# Altium project Gastroscopy-CutController.PrjPcb (part 2 of 2)

## Sheet Gastroscopy-CutController_Accelerometer.SchDoc: Accelerometer
size 279 x 215 mm; Date: not used; ApprovedBy: not used; CheckedBy: not used; Author: not used; CompanyName: MRobot, LCC; DrawnBy: not used; Engineer: Podlesnyi Vasilii; Organization: not used; Address1: nab. reki Karpovki, d. 5/3E; Address2: Saint-Petersburg, 197022; Address3: Ph: +7 (911) 701-51-99; Address4: not used; DocumentNumber: 0000-0000; Revision: 0.1.0; SheetNumber: 3; SheetTotal: 8; ProjectTitle: Gastroscopy CutController; Time: not used; ImagePath: not used; Application_BuildNumber: not used
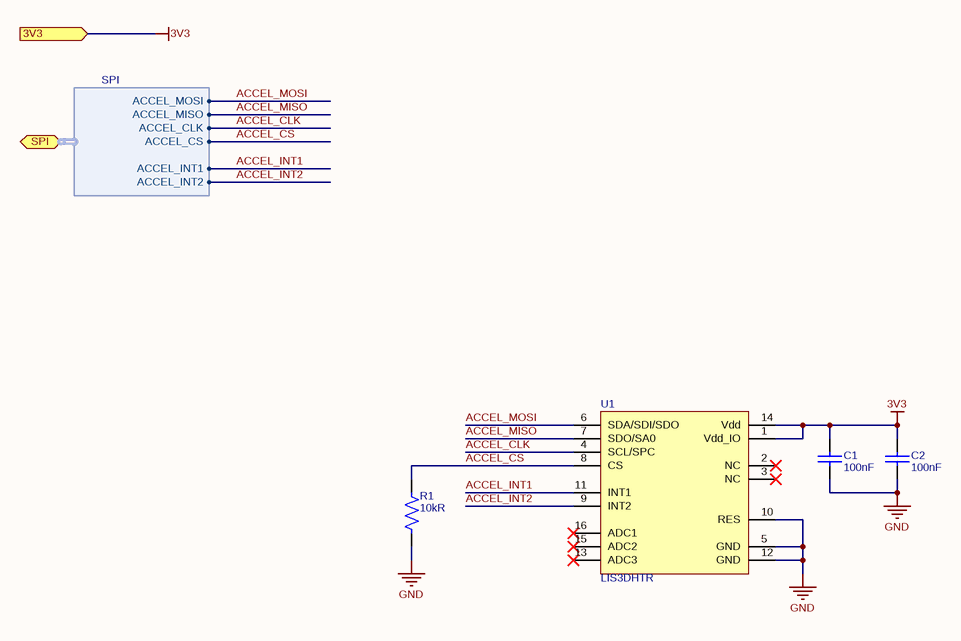
[diagram p4: Gastroscopy-CutController_Accelerometer.SchDoc]

### Parts
C1  100nF  [CAP_0603]
C2  100nF  [CAP_0603]
R1  10kR  [RES_0603]
U1  LIS3DHTR  [LIS3DHTR]

### Ports
3V3 (in), SPI (bidir, harness SPI)

### Harnesses
SPI: ACCEL_MOSI, ACCEL_MISO, ACCEL_CLK, ACCEL_INT1, ACCEL_CS, ACCEL_INT2

### Nets
3V3: C1.1 C2.1 U1.1(Vdd_IO) U1.14(Vdd) ; port 3V3
GND: C1.2 C2.2 R1.2 U1.5(GND) U1.10(RES) U1.12(GND)
ACCEL_CLK: U1.4(SCL/SPC) ; port SPI.ACCEL_CLK
ACCEL_CS: R1.1 U1.8(CS) ; port SPI.ACCEL_CS
ACCEL_INT1: U1.11(INT1) ; port SPI.ACCEL_INT1
ACCEL_INT2: U1.9(INT2) ; port SPI.ACCEL_INT2
ACCEL_MISO: U1.7(SDO/SA0) ; port SPI.ACCEL_MISO
ACCEL_MOSI: U1.6(SDA/SDI/SDO) ; port SPI.ACCEL_MOSI

Not connected (* = marked no-connect by the designer): U1 2(NC)* 3(NC)* 13(ADC3)* 15(ADC2)* 16(ADC1)*

### Notes on the sheet
- Title:
- Date:
- Size A
- Project:
- Number:
- Time:
- Sheet
- Revision
- of
- Engineer:
- www.mrobots.ru <http://mrobots.ru/>
- File:

### Library data of the parts
C1 C2 = CL10B104KB8NNNL: CAP CER 0.1UF 50V X7R 0603; Manufacturer 1: Samsung; Tolerance: 10%; Supplier 1: Digi-Key; Manufacturer Part Number 1: CL10B104KB8NNNL; RoHS: Yes; Category: Ceramic Capacitors; Stock 1: 2348404; Pricing 1: 15000=0,00532, 30000=0,00506 (USD); Mount: Surface Mount; Case/Package: 0603; Min Operating Temperature: -55°C; Max Operating Temperature: 125°C; Capacitance: 100nF; Packaging: Tape and Reel; Package Quantity: 15000; Voltage Rating: 50V; Dielectric: X7R; Voltage Rating (DC): 50V; Series: CL; Construction: Flat; Length: 1.6mm; Width: 0.031inch; Height: 0.8mm; Thickness: 0.035inch; Depth: 0.8mm; Radiation Hardening: No; RoHS Compliant: Yes; ComponentLink1URL: https://datasheet.ciiva.com/26838/getdatasheetpartid-357523-26838415.pdf?src-supplier=Verical; ComponentLink1Description: https://datasheet.ciiva.com/26838/getdatasheetpartid-357523-26838415.pdf?src-supplier=Verical; ComponentLink2URL: https://datasheet.ciiva.com/25741/cl10b104kb8nnnl-25741341.pdf?src-supplier=Digi-Key; ComponentLink2Description: https://datasheet.ciiva.com/25741/cl10b104kb8nnnl-25741341.pdf?src-supplier=Digi-Key; Supplier Part Number 1: 1276-CL10B104KB8NNNLTR-ND
R1 = RC0603FR-0710KL: RES 10K OHM 1% 1/10W 0603; Manufacturer 1: Yageo; Voltage Rating (DC): 50V; Temperature Coefficient: 100ppm/°C; Power Rating: 100mW; Voltage Rating: 75V; Supplier 1: Arrow Electronics; RoHS: Yes; Category: Chip SMD Resistors; Stock 1: 4950000; Pricing 1: 5000=0,00240 (USD); Case/Package: 0603; Number of Pins: 2; Case Code (Imperial): 0603; Case Code (Metric): 1608; Weight: 7.1E-05oz; Size Code: 0603; Min Operating Temperature: -55°C; Max Operating Temperature: 155°C; Packaging: Tape and Reel; Resistance: 10kR; Tolerance: 1%; Resistor Type: Thick Film; Termination: SMD/SMT; Features: Moisture Resistant; Series: RC; Max Power Dissipation: 100mW; Number of Terminations: 2; Resistance Tolerance: 1%; Construction: Rectangular; Length: 1.6mm; Width: 0.8mm; Height: 0.45mm; Depth: 0.8mm; Lead Pitch: 0.3mm; REACH SVHC: Unknown; Lead Free: Lead Free; Military Standard: Not; RoHS Compliant: Yes; ComponentLink1URL: https://datasheet.ciiva.com/7660/38590-7660789.pdf?src-supplier=Element14; ComponentLink1Description: https://datasheet.ciiva.com/7660/38590-7660789.pdf?src-supplier=Element14; ComponentLink2URL: https://datasheet.ciiva.com/7983/443971-7983596.pdf?src-supplier=Element14; ComponentLink2Description: https://datasheet.ciiva.com/7983/443971-7983596.pdf?src-supplier=Element14; ComponentLink3URL: https://datasheet.ciiva.com/22747/443971-22747519.pdf?src-supplier=Element14; ComponentLink3Description: https://datasheet.ciiva.com/22747/443971-22747519.pdf?src-supplier=Element14; ComponentLink4URL: https://datasheet.ciiva.com/46440/1868787-46440891.pdf?src-supplier=Element14; ComponentLink4Description: https://datasheet.ciiva.com/46440/1868787-46440891.pdf?src-supplier=Element14; ComponentLink5URL: https://datasheet.ciiva.com/7746/1738695-7746239.pdf?src-supplier=Element14; ComponentLink5Description: https://datasheet.ciiva.com/7746/1738695-7746239.pdf?src-supplier=Element14; Supplier Part Number 1: RC0603FR-0710KL; Manufacturer Part Number 1: RC0603FR-0710KL
U1 = LIS3DHTR: ACCEL 2-16G I2C/SPI 16LGA; Manufacturer 1: STMicroelectronics; Max Supply Voltage: 3.6V; Min Supply Voltage: 1.71V; Operating Supply Voltage: 2.5V; Bandwidth: 5kHz; Interface: I2C,SPI; Resolution: 16b; Operating Supply Current: 11uA; Sensor Type: 3 Axis; Output Type: Digital; Axis: X, Y, Z; Supplier 1: Future Electronics; Manufacturer Part Number 1: LIS3DHTR; RoHS: Yes; Category: Accelerometers; Pricing 1: 4000=0,99000 (USD); Case/Package: LGA; Number of Pins: 16; Contact Plating: Gold; Min Operating Temperature: -40°C; Max Operating Temperature: 85°C; Package Quantity: 4000; Packaging: Tape and Reel; Max Supply Voltage (DC): 3.6V; Min Supply Voltage (DC): 1.71V; Series: -; Length: 3mm; Width: 3mm; Height: 1mm; Depth: 3mm; Radiation Hardening: No; Reach SVHC Compliant: Yes; Lead Free: Lead Free; RoHS Compliant: Yes; ComponentLink1URL: https://datasheet.ciiva.com/7621/1718591-7621744.pdf?src-supplier=Element14; ComponentLink1Description: https://datasheet.ciiva.com/7621/1718591-7621744.pdf?src-supplier=Element14; ComponentLink2URL: https://datasheet.ciiva.com/5296/cd00274221-117431-5296513.pdf?src-supplier=Mouser; ComponentLink2Description: https://datasheet.ciiva.com/5296/cd00274221-117431-5296513.pdf?src-supplier=Mouser; ComponentLink3URL: https://datasheet.ciiva.com/2810/cd00274221-2810009.pdf?src-supplier=Digi-Key; ComponentLink3Description: https://datasheet.ciiva.com/2810/cd00274221-2810009.pdf?src-supplier=Digi-Key; ComponentLink4URL: https://datasheet.ciiva.com/2810/cd00274221-2810008.pdf?src-supplier=Digi-Key; ComponentLink4Description: https://datasheet.ciiva.com/2810/cd00274221-2810008.pdf?src-supplier=Digi-Key; ComponentLink5URL: https://datasheet.ciiva.com/2810/cd00274221-2810010.pdf?src-supplier=Digi-Key; ComponentLink5Description: https://datasheet.ciiva.com/2810/cd00274221-2810010.pdf?src-supplier=Digi-Key; ComponentLink6URL: https://datasheet.ciiva.com/48495/cd00274221-48495849.pdf?src-supplier=Avnet; ComponentLink6Description: https://datasheet.ciiva.com/48495/cd00274221-48495849.pdf?src-supplier=Avnet; ComponentLink7URL: https://datasheet.ciiva.com/3271/cd00274221-3271807.pdf?src-supplier=Avnet; ComponentLink7Description: https://datasheet.ciiva.com/3271/cd00274221-3271807.pdf?src-supplier=Avnet; ComponentLink8URL: https://datasheet.ciiva.com/16216/cd00274221-16216362.pdf?src-supplier=Future+Electronics; ComponentLink8Description: https://datasheet.ciiva.com/16216/cd00274221-16216362.pdf?src-supplier=Future+Electronics; Supplier Part Number 1: 9001914

## Sheet Gastroscopy-CutController_Button.SchDoc: Buttons
size 279 x 215 mm; Date: not used; ApprovedBy: not used; CheckedBy: not used; Author: not used; CompanyName: MRobot, LCC; DrawnBy: not used; Engineer: Podlesnyi Vasilii; Organization: not used; Address1: nab. reki Karpovki, d. 5/3E; Address2: Saint-Petersburg, 197022; Address3: Ph: +7 (911) 701-51-99; Address4: not used; DocumentNumber: 0000-0000; Revision: 0.1.0; SheetNumber: 4; SheetTotal: 8; ProjectTitle: Gastroscopy CutController; Time: not used; ImagePath: not used; Application_BuildNumber: not used
Used 4 times, as channels Overview/Buttons1, Overview/Buttons2, Overview/Buttons3, Overview/Buttons4. Parts and nets are listed once, with the designators drawn on the sheet.
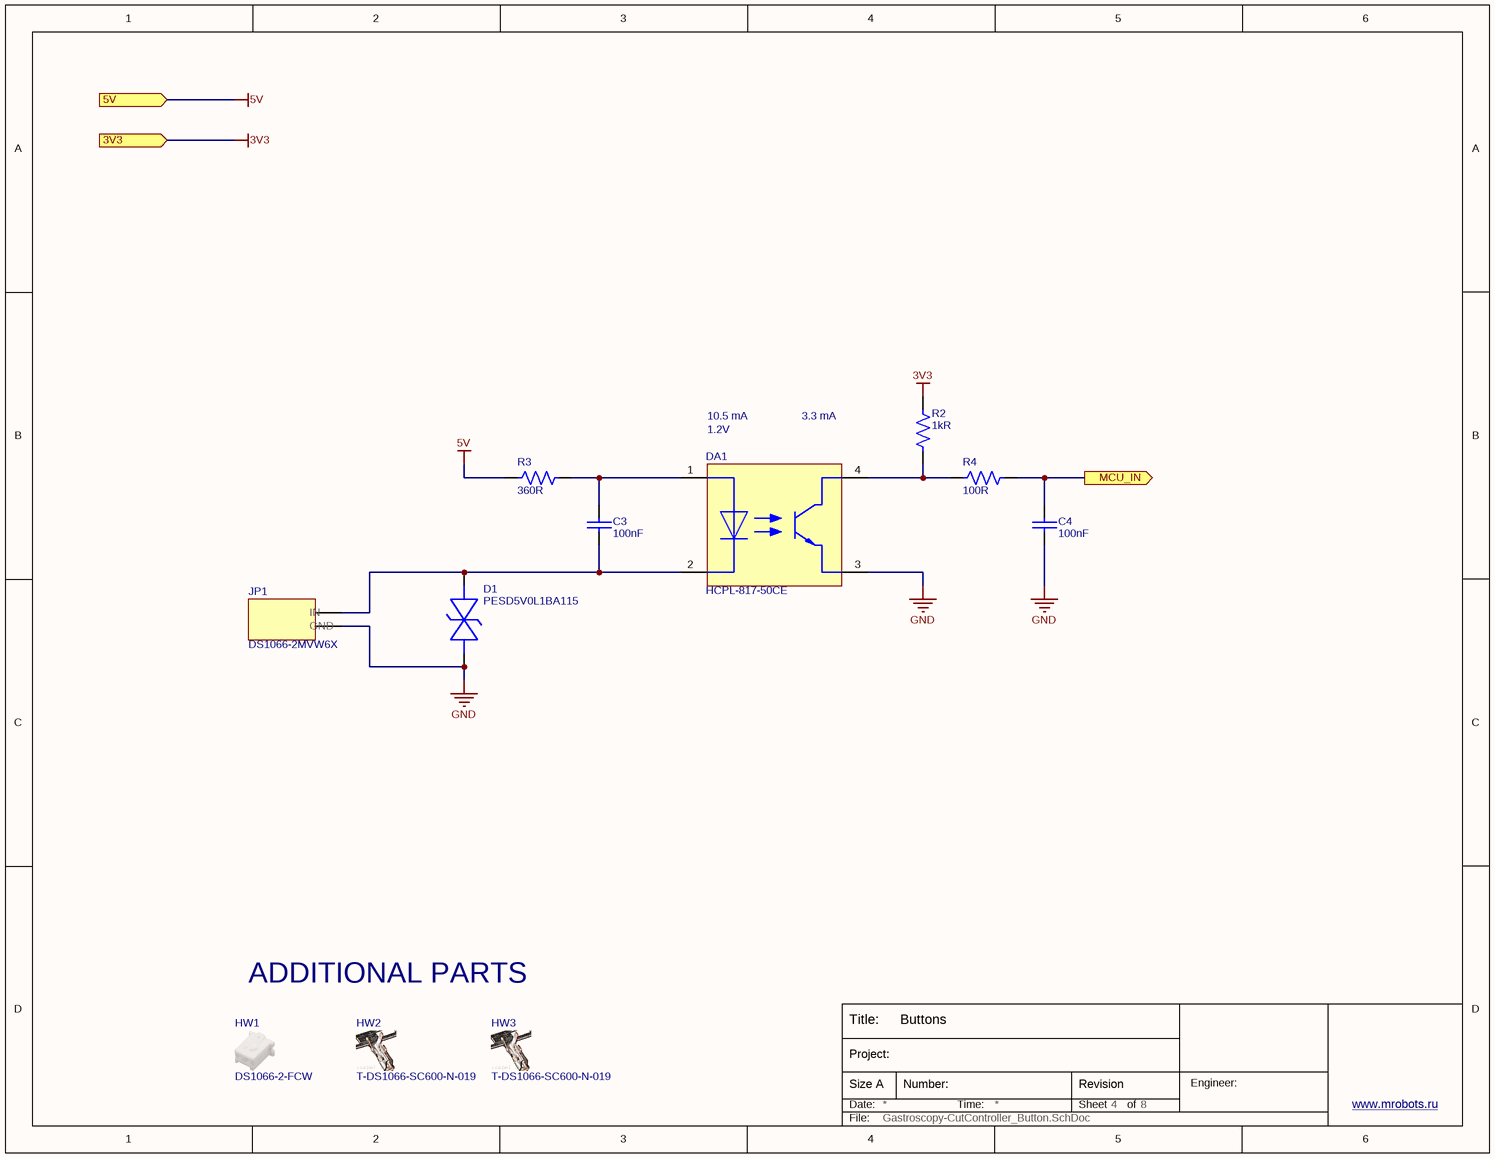
[diagram p5: Gastroscopy-CutController_Button.SchDoc]

### Parts
C3  100nF  [CAP_0603]
C4  100nF  [CAP_0603]
D1  PESD5V0L1BA115  [SOD-323]
DA1  HCPL-817-50CE  [HCPL-817-50CE]
HW1  DS1066-2-FCW  (mechanical)
HW2  T-DS1066-SC600-N-019  (mechanical)
HW3  T-DS1066-SC600-N-019  (mechanical)
JP1  DS1066-2MVW6X  [DS1066-2MVW6X]
R2  1kR  [RES_0603]
R3  360R  [RES_0603]
R4  100R  [RES_0603]

### Ports
3V3 (in), 5V (in), MCU_IN (out)

### Nets
3V3: R2.1 ; port 3V3
5V: R3.1 ; port 5V
GND: C4.2 D1.2 DA1.3(EMITTER) JP1.2
MCU_IN: C4.1 R4.1 ; port MCU_IN
NetC3_1: C3.1 DA1.1(ANODE) R3.2
NetC3_2: C3.2 D1.1 DA1.2(CATHODE) JP1.1
NetDA1_4: DA1.4(COLLECTOR) R2.2 R4.2

### Channels
Overview/Buttons1: designators C3=C3 C4=C4 D1=D1 DA1=DA1 HW1=HW1A HW2=HW2A HW3=HW3A JP1=JP1 R2=R3 R3=R2 R4=R4; ports 3V3=3V3 5V=5V MCU_IN=MCU_IN1
Overview/Buttons2: designators C3=C5#1 C4=C6#1 D1=D2#1 DA1=DA2#2 HW1=HW1B HW2=HW2B HW3=HW3B JP1=JP2#1 R2=R6#1 R3=R5#1 R4=R7#1; ports 3V3=3V3 5V=5V MCU_IN=MCU_IN2
Overview/Buttons3: designators C3=C7#2 C4=C8#2 D1=D3#2 DA1=DA3 HW1=HW1C HW2=HW2C HW3=HW3C JP1=JP3#1 R2=R9#2 R3=R8#2 R4=R10#2; ports 3V3=3V3 5V=5V MCU_IN=MCU_IN3
Overview/Buttons4: designators C3=C9#2 C4=C10#2 D1=D4#2 DA1=DA4 HW1=HW1D HW2=HW2D HW3=HW3D JP1=JP4#2 R2=R12#2 R3=R11#2 R4=R13#1; ports 3V3=3V3 5V=5V MCU_IN=MCU_IN4

### Notes on the sheet
- (near DA1) 1.2V
- 10.5 mA
- 3.3 mA
- ADDITIONAL PARTS
- Title:
- Date:
- Size A
- Project:
- Number:
- Time:
- Sheet
- Revision
- of
- Engineer:
- www.mrobots.ru <http://mrobots.ru/>
- File:

### Library data of the parts
C3 C4 = CL10B104KB8NNNL: as C1 on sheet Gastroscopy-CutController_Accelerometer; Supplier 1: Digi-Key; Manufacturer Part Number 1: CL10B104KB8NNNL; RoHS: Yes; Category: Ceramic Capacitors; Stock 1: 2348404; Pricing 1: 15000=0,00532, 30000=0,00506 (USD); Mount: Surface Mount; Case/Package: 0603; Min Operating Temperature: -55°C; Max Operating Temperature: 125°C; Capacitance: 100nF; Packaging: Tape and Reel; Package Quantity: 15000; Voltage Rating: 50V; Dielectric: X7R; Voltage Rating (DC): 50V; Series: CL; Construction: Flat; Length: 1.6mm; Width: 0.031inch; Height: 0.8mm; Thickness: 0.035inch; Depth: 0.8mm; Radiation Hardening: No; RoHS Compliant: Yes; ComponentLink1URL: https://datasheet.ciiva.com/26838/getdatasheetpartid-357523-26838415.pdf?src-supplier=Verical; ComponentLink1Description: https://datasheet.ciiva.com/26838/getdatasheetpartid-357523-26838415.pdf?src-supplier=Verical; ComponentLink2URL: https://datasheet.ciiva.com/25741/cl10b104kb8nnnl-25741341.pdf?src-supplier=Digi-Key; ComponentLink2Description: https://datasheet.ciiva.com/25741/cl10b104kb8nnnl-25741341.pdf?src-supplier=Digi-Key; Supplier Part Number 1: 1276-CL10B104KB8NNNLTR-ND
D1 = PESD5V0L1BA,115: TVS DIODE 5VWM 33VC SOD323; Manufacturer 1: NXP Semiconductors; Description: Diode Esd Prot; Direction: Bidirectional; Capacitance: 75pF; Number of Channels: 1; Reverse Breakdown Voltage: 7V; Operating Supply Voltage: 5V; Max Surge Current: 15A; Clamping Voltage: 33V; Peak Pulse Power: 500W; Power Line Protection: No; Leakage Current: 1uA; Max Breakdown Voltage: 8.2V; Test Current: 5mA; Element Configuration: Single; Diode Type: ZENER; Supplier 1: Newark; Manufacturer Part Number 1: PESD5V0L1BA115; RoHS: Yes; Category: Uncategorized; Mount: Surface Mount; Number of Pins: 2; Weight: 0.01lb; Contact Plating: Tin; Min Operating Temperature: -65°C; Max Operating Temperature: 150°C; Package Quantity: 1; Packaging: Cut Tape; Number of Elements: 1; Number of Bidirectional Channels: 1; Reverse Standoff Voltage: 5V; Min Breakdown Voltage: 7V; Polarity: Bidirectional; Breakdown Voltage: 7V; Termination: SMD/SMT; Working Voltage: 5V; Peak Pulse Current: 15A; Max Power Dissipation: 500W; Resistor Type: Zener; Series: -; Clamping Voltage-Max: 33V; Length: 1.8mm; Width: 0.25inch; Height: 0.25inch; Depth: 1.35mm; Radiation Hardening: No; Reach SVHC Compliant: Yes; Lead Free: Lead Free; ComponentLink1URL: https://datasheet.ciiva.com/334/pesdxl1ba-ser-334048.pdf?src-supplier=Digi-Key; ComponentLink1Description: https://datasheet.ciiva.com/334/pesdxl1ba-ser-334048.pdf?src-supplier=Digi-Key; ComponentLink2URL: https://datasheet.ciiva.com/1219/682594-1219455.pdf?src-supplier=Newark; ComponentLink2Description: https://datasheet.ciiva.com/1219/682594-1219455.pdf?src-supplier=Newark; ComponentLink3URL: https://datasheet.ciiva.com/334/pesdxl1ba-ser-334050.pdf?src-supplier=Digi-Key; ComponentLink3Description: https://datasheet.ciiva.com/334/pesdxl1ba-ser-334050.pdf?src-supplier=Digi-Key; ComponentLink4URL: https://datasheet.ciiva.com/334/pesdxl1ba-ser-334051.pdf?src-supplier=Digi-Key; ComponentLink4Description: https://datasheet.ciiva.com/334/pesdxl1ba-ser-334051.pdf?src-supplier=Digi-Key; ComponentLink5URL: https://datasheet.ciiva.com/6574/pesdxl1ba-ser-6574197.pdf?src-supplier=Digi-Key; ComponentLink5Description: https://datasheet.ciiva.com/6574/pesdxl1ba-ser-6574197.pdf?src-supplier=Digi-Key; Supplier Part Number 1: 70R7330
DA1 = HCPL-817-50CE: OPTOISOLATOR 5KV TRANSISTOR 4SMD; Manufacturer 1: Broadcom Avago; Reverse Breakdown Voltage: 6V; Forward Voltage: 1.2V; Forward Current: 50mA; Rise Time: 18000ns; Max Power Dissipation: 200mW; Number of Channels: 1; Collector Emitter Voltage (VCEO): 35V; Collector Emitter Saturation Voltage: 200mV; Max Output Voltage: 70V; Current Transfer Ratio: 400%; Input Current: 20mA; Input Type: DC; Approvals: UL; Supplier 1: Mouser; RoHS: Yes; Category: Optocouplers; Stock 1: 53747; Pricing 1: 1=0,55000, 10=0,35900, 50=0,35900, 100=0,23700, 1000=0,18200, 10000=0,15000 (USD); Mount: Surface Mount; Case/Package: SMD/SMT; Number of Pins: 4; Min Operating Temperature: -30°C; Max Operating Temperature: 100°C; Package Quantity: 1000; Packaging: Tape and Reel; Max Collector Current: 50mA; Output Current per Channel: 50mA; Number of Elements: 1; Power Dissipation: 200mW; Fall Time: 18000ns; Max Input Current: 50mA; Collector Emitter Breakdown Voltage: 70V; Isolation Voltage: 5kV; Number of Circuits: 1; Output Voltage: 70V; Series: -; Collector-emitter Voltage-Max: 200mV; Lead Free: Lead Free; RoHS Compliant: Yes; ComponentLink1URL: https://datasheet.ciiva.com/32424/hcpl-817-00ae-eng-tds-32424469.pdf?src-supplier=Distrelec; ComponentLink1Description: https://datasheet.ciiva.com/32424/hcpl-817-00ae-eng-tds-32424469.pdf?src-supplier=Distrelec; ComponentLink2URL: https://datasheet.ciiva.com/4702/v02-0265en-106799-4702156.pdf?src-supplier=Mouser; ComponentLink2Description: https://datasheet.ciiva.com/4702/v02-0265en-106799-4702156.pdf?src-supplier=Mouser; Supplier Part Number 1: 630-HCPL-817-50CE; Manufacturer Part Number 1: HCPL-817-50CE
HW1 = DS1066-2-FCW: CONN SOCKET 2POS 2MM; Manufacturer 1: Connfly electronic (Zhenqin); Manufacturer Part Number 1: DS1066-2-FCW
HW2 HW3 = T-DS1066-SC600-N-019: СONNECTOR DS1066; Manufacturer 1: Connfly electronic (Zhenqin); Manufacturer Part Number 1: T-DS1066-SC600-N-019
JP1 = DS1066-2MVW6X: CONN HEADER 2POS 2MM; Manufacturer 1: Connfly electronic (Zhenqin); Contact_1: IN; Contact_2: GND; Manufacturer Part Number 1: DS1066-2MVW6X
R2 = RC0603FR-071KL: RES 1K OHM 1% 1/10W 0603; Manufacturer 1: Yageo; Temperature Coefficient: 100ppm/°C; Power Rating: 100mW; Voltage Rating: 50V; Supplier 1: Arrow Electronics; Manufacturer Part Number 1: RC0603FR-071KL; RoHS: Yes; Category: Chip SMD Resistors; Stock 1: 480000; Pricing 1: 5000=0,00240, 10000=0,00230, 25000=0,00220, 125000=0,00190 (USD); Case/Package: 0603; Contact Plating: Tin,Matte; Case Code (Imperial): 0603; Case Code (Metric): 1608; Size Code: 0603; Min Operating Temperature: -55°C; Max Operating Temperature: 155°C; Tolerance: 1%; Resistance: 1kR; Packaging: Tape and Reel; Resistor Type: Thick Film; Termination: SMD/SMT; Features: Moisture Resistant; Series: RC; Max Power Dissipation: 100mW; Number of Terminations: 2; Technology: THICK FILM; Resistance Tolerance: 1%; Construction: Rectangular; Length: 1.6mm; Height: 0.45mm; Depth: 0.8mm; Radiation Hardening: No; REACH SVHC: No SVHC; Lead Free: Lead Free; Military Standard: Not; RoHS Compliant: Yes; Supplier Part Number 1: RC0603FR-071KL
R3 = RC0603FR-07360RL: RES 360 OHM 1% 1/10W 0603; Manufacturer 1: Yageo; Power Rating: 100mW; Voltage Rating: 50V; Temperature Coefficient: 100ppm/°C; Supplier 1: Arrow Electronics; RoHS: Yes; Category: Chip SMD Resistors; Stock 1: 7884; Pricing 1: 1=0,05320, 10=0,01120, 100=0,00760, 250=0,00660, 1000=0,00380, 3000=0,00370, 6000=0,00230 (USD); Case/Package: 0603; Case Code (Metric): 1608; Case Code (Imperial): 0603; Size Code: 0603; Min Operating Temperature: -55°C; Max Operating Temperature: 155°C; Packaging: Tape and Reel; Resistance: 360R; Tolerance: 1%; Package Quantity: 1; Resistor Type: Thick Film; Number of Terminations: 2; Termination: SMD/SMT; Max Power Dissipation: 100mW; Voltage Rating (DC): 50V; Features: Moisture Resistant; Series: RC; Construction: Rectangular; Length: 1.6mm; Width: 0.031inch; Height: 0.022inch; Depth: 0.8mm; Military Standard: Not; Lead Free: Lead Free; RoHS Compliant: Yes; ComponentLink1URL: https://datasheet.ciiva.com/2454/pyu-r-int-thick-7-2454271.pdf?src-supplier=Digi-Key; ComponentLink1Description: https://datasheet.ciiva.com/2454/pyu-r-int-thick-7-2454271.pdf?src-supplier=Digi-Key; ComponentLink2URL: https://datasheet.ciiva.com/2454/pyu-r-int-thick-7-2454272.pdf?src-supplier=Digi-Key; ComponentLink2Description: https://datasheet.ciiva.com/2454/pyu-r-int-thick-7-2454272.pdf?src-supplier=Digi-Key; ComponentLink3URL: https://datasheet.ciiva.com/2454/pyu-r-int-thick-7-2454270.pdf?src-supplier=Digi-Key; ComponentLink3Description: https://datasheet.ciiva.com/2454/pyu-r-int-thick-7-2454270.pdf?src-supplier=Digi-Key; ComponentLink4URL: https://datasheet.ciiva.com/12558/rc0603-272842-12558645.pdf?src-supplier=Mouser; ComponentLink4Description: https://datasheet.ciiva.com/12558/rc0603-272842-12558645.pdf?src-supplier=Mouser; Supplier Part Number 1: RC0603FR-07360RL; Manufacturer Part Number 1: RC0603FR-07360RL
R4 = RC0603FR-07100RL: RES 100 OHM 1% 1/10W 0603; Manufacturer 1: Yageo; Voltage Rating (DC): 50V; Temperature Coefficient: 100ppm/°C; Power Rating: 100mW; Supplier 1: Arrow Electronics; RoHS: Yes; Category: Chip SMD Resistors; Stock 1: 17580000; Pricing 1: 5000=0,00180 (USD); Case/Package: 0603; Number of Pins: 2; Case Code (Imperial): 0603; Case Code (Metric): 1608; Size Code: 0603; Min Operating Temperature: -55°C; Max Operating Temperature: 155°C; Resistance: 100R; Tolerance: 1%; Packaging: Tape and Reel; Resistor Type: Thick Film; Voltage Rating: 50V; Termination: SMD/SMT; Features: Moisture Resistant; Series: RC; Max Power Dissipation: 100mW; Number of Terminations: 2; Construction: Rectangular; Resistance Tolerance: 1%; Technology: THICK FILM; Length: 1.6mm; Width: 0.8mm; Height: 0.45mm; Depth: 0.8mm; REACH SVHC: Unknown; Lead Free: Lead Free; Military Standard: Not; RoHS Compliant: Yes; Supplier Part Number 1: RC0603FR-07100RL; Manufacturer Part Number 1: RC0603FR-07100RL

## Sheet Gastroscopy-CutController_Relay.SchDoc: Relay
size 279 x 215 mm; Date: not used; ApprovedBy: not used; CheckedBy: not used; Author: not used; CompanyName: MRobot, LCC; DrawnBy: not used; Engineer: Podlesnyi Vasilii; Organization: not used; Address1: nab. reki Karpovki, d. 5/3E; Address2: Saint-Petersburg, 197022; Address3: Ph: +7 (911) 701-51-99; Address4: not used; DocumentNumber: 0000-0000; Revision: 0.1.0; SheetNumber: 7; SheetTotal: 8; ProjectTitle: Gastroscopy CutController; Time: not used; ImagePath: not used; Application_BuildNumber: not used
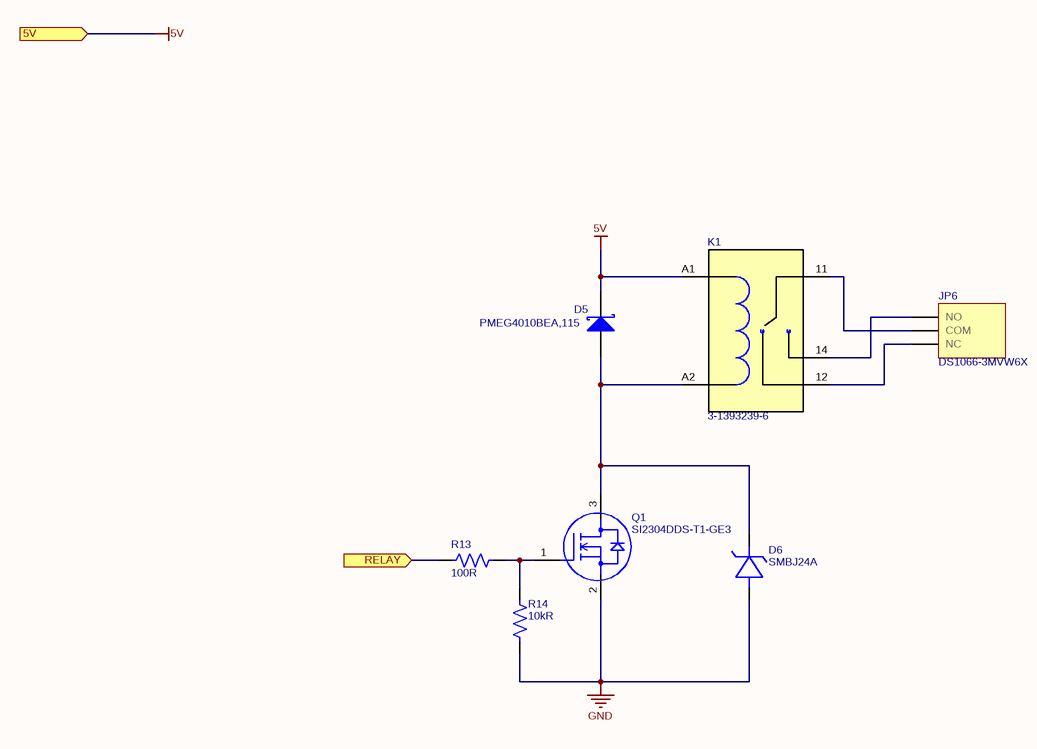
[diagram p6: Gastroscopy-CutController_Relay.SchDoc]

### Parts
(Parts that share a designator on the sheet are numbered #1, #2 ... from top to bottom, then left to right.)
D5  PMEG4010BEA,115  [SOD-323]
D6  SMBJ24A  [SMB]
JP6  DS1066-3MVW6X  [DS1066-3MVW6X]
K1  3-1393239-6  [3-1393239-6]
Q1  SI2304DDS-T1-GE3  [SOT-23-3]
R13#2  100R  [RES_0603]
R14  10kR  [RES_0603]

### Ports
5V (in), RELAY (in)

### Nets
5V: D5.1(K) K1.A1 ; port 5V
GND: D6.2(A) Q1.2(S) R14.2
RELAY: R13#2.1 ; port RELAY
NetD5_2: D5.2(A) D6.1(C) K1.A2 Q1.3(D)
NetJP6_1: JP6.1 K1.14(NO)
NetJP6_2: JP6.2 K1.11(COM)
NetJP6_3: JP6.3 K1.12(NC)
NetQ1_1: Q1.1(G) R13#2.2 R14.1

### Notes on the sheet
- Title:
- Date:
- Size A
- Project:
- Number:
- Time:
- Sheet
- Revision
- of
- Engineer:
- www.mrobots.ru <http://mrobots.ru/>
- File:

### Library data of the parts
D5 = PMEG4010BEA,115: DIODE SCHOTTKY 40V 1A SOD323; Manufacturer: Nexperia; Supplier 1: RSComponents; Manufacturer Part Number: PMEG4010BEA,115; RoHS: Yes; Category: Rectifier Diodes; Stock 1: 163320; Pricing 1: 160=0,18400, 760=0,16200, 1500=0,13800 (GBP); RoHS Compliant: Yes; ComponentLink1URL: http://www.farnell.com/datasheets/689588.pdf?src-supplier=Farnell; ComponentLink1Description: http://www.farnell.com/datasheets/689588.pdf?src-supplier=Farnell; Supplier Part Number 1: 485644P
D6 = SMBJ24A: TVS DIODE 24VWM 38.9VC SMB; Manufacturer 1: Bourns; Direction: Unidirectional; Number of Elements: 1; Reverse Breakdown Voltage: 26.7V; Max Surge Current: 100A; Reverse Standoff Voltage: 24V; Clamping Voltage: 38.9V; Peak Pulse Power: 600W; Power Line Protection: No; Breakdown Voltage: 30.7V; Max Reverse Leakage Current: 5uA; Test Current: 1mA; Peak Pulse Current: 15.4A; Element Configuration: Single; Diode Type: ZENER; Operating Supply Voltage: 3.5V; ESD Protection: Yes; ComponentLink6URL: https://datasheet.ciiva.com/330/littelfuse-tvs-diode-smaj-datasheet-pdf-330796.pdf?src-supplier=Digi-Key; ComponentLink6Description: https://datasheet.ciiva.com/330/littelfuse-tvs-diode-smaj-datasheet-pdf-330796.pdf?src-supplier=Digi-Key; Supplier 1: Arrow Electronics; RoHS: Yes; Category: TVS Diodes; Stock 1: 14; Pricing 1: 1=0,52680, 10=0,35320 (USD); Mount: Surface Mount; Case/Package: SMB; Number of Pins: 2; Min Operating Temperature: -55°C; Max Operating Temperature: 150°C; Packaging: Tape and Reel; Package Quantity: 1; Number of Unidirectional Channels: 1; Min Breakdown Voltage: 26.7V; Polarity: Unidirectional; Termination: SMD/SMT; Max Breakdown Voltage: 30.7V; Max Power Dissipation: 600W; Leakage Current: 5uA; Resistor Type: Zener; Series: SMBJ; Number of Channels: 1; Length: 4.57mm; Width: 3.94mm; Height: 2.42mm; Radiation Hardening: No; RoHS Compliant: Yes; REACH SVHC: No SVHC; ComponentLink1URL: https://datasheet.ciiva.com/30478/0900766b81189a19-30478832.pdf?src-supplier=RSComponents; ComponentLink1Description: https://datasheet.ciiva.com/30478/0900766b81189a19-30478832.pdf?src-supplier=RSComponents; ComponentLink2URL: https://datasheet.ciiva.com/3022/smbj-3022496.pdf?src-supplier=Avnet; ComponentLink2Description: https://datasheet.ciiva.com/3022/smbj-3022496.pdf?src-supplier=Avnet; ComponentLink3URL: https://datasheet.ciiva.com/3022/smbj-3022497.pdf?src-supplier=Avnet; ComponentLink3Description: https://datasheet.ciiva.com/3022/smbj-3022497.pdf?src-supplier=Avnet; ComponentLink4URL: https://datasheet.ciiva.com/342/smbj-342022.pdf?src-supplier=Digi-Key; ComponentLink4Description: https://datasheet.ciiva.com/342/smbj-342022.pdf?src-supplier=Digi-Key; ComponentLink5URL: https://datasheet.ciiva.com/8031/1677318-8031064.pdf?src-supplier=Element14; ComponentLink5Description: https://datasheet.ciiva.com/8031/1677318-8031064.pdf?src-supplier=Element14; ComponentLink7URL: https://datasheet.ciiva.com/28410/1677318-28410012.pdf?src-supplier=Element14; ComponentLink7Description: https://datasheet.ciiva.com/28410/1677318-28410012.pdf?src-supplier=Element14; ComponentLink8URL: https://datasheet.ciiva.com/342/smbj-342020.pdf?src-supplier=Digi-Key; ComponentLink8Description: https://datasheet.ciiva.com/342/smbj-342020.pdf?src-supplier=Digi-Key; ComponentLink9URL: https://datasheet.ciiva.com/342/smbj-342021.pdf?src-supplier=Digi-Key; ComponentLink9Description: https://datasheet.ciiva.com/342/smbj-342021.pdf?src-supplier=Digi-Key; ComponentLink10URL: https://datasheet.ciiva.com/16237/smbj-16237468.pdf?src-supplier=Onlinecomponents.com; ComponentLink10Description: https://datasheet.ciiva.com/16237/smbj-16237468.pdf?src-supplier=Onlinecomponents.com; ComponentLink11URL: https://datasheet.ciiva.com/48712/001056314-da-01-en-tvs-diode-smbj24a-do-214aa-bou-48712566.pdf?src-supplier=Conrad; ComponentLink11Description: https://datasheet.ciiva.com/48712/001056314-da-01-en-tvs-diode-smbj24a-do-214aa-bou-48712566.pdf?src-supplier=Conrad; Supplier Part Number 1: SMBJ24A; Manufacturer Part Number 1: SMBJ24A
JP6 = DS1066-3MVW6X: CONN PLUG 3POS 2MM; Manufacturer 1: Connfly electronic (Zhenqin); Contact_1: NO; Contact_2: COM; Contact_3: NC; Manufacturer Part Number 1: DS1066-3MVW6X
K1 = 3-1393239-6: RELAY GEN PURPOSE SPDT 10A 5V; Manufacturer 1: TE Connectivity Schrack; Supplier 1: Arrow Electronics; RoHS: Yes; Category: Signal Relays; Stock 1: 3333; Pricing 1: 1=1,30120 (USD); ComponentLink1URL: https://datasheet.ciiva.com/2409/eng-ds-rt1-sensitive-0910-2409155.pdf?src-supplier=Avnet; ComponentLink1Description: https://datasheet.ciiva.com/2409/eng-ds-rt1-sensitive-0910-2409155.pdf?src-supplier=Avnet; ComponentLink2URL: https://datasheet.ciiva.com/14146/rt1sens-eng-datasheet-14146563.pdf?src-supplier=Distrelec; ComponentLink2Description: https://datasheet.ciiva.com/14146/rt1sens-eng-datasheet-14146563.pdf?src-supplier=Distrelec; ComponentLink3URL: https://datasheet.ciiva.com/16307/3-1393239-6-16307647.pdf?src-supplier=Future+Electronics; ComponentLink3Description: https://datasheet.ciiva.com/16307/3-1393239-6-16307647.pdf?src-supplier=Future+Electronics; ComponentLink4URL: https://datasheet.ciiva.com/14190/eng-ds-rt1-sensitive-0411-14190113.pdf?src-supplier=Avnet; ComponentLink4Description: https://datasheet.ciiva.com/14190/eng-ds-rt1-sensitive-0411-14190113.pdf?src-supplier=Avnet; ComponentLink5URL: https://datasheet.ciiva.com/30127/eng-ds-rt1-sensitive-0411-30127511.pdf?src-supplier=Onlinecomponents.com; ComponentLink5Description: https://datasheet.ciiva.com/30127/eng-ds-rt1-sensitive-0411-30127511.pdf?src-supplier=Onlinecomponents.com; Supplier Part Number 1: RT174005; Manufacturer Part Number 1: 3-1393239-6
Q1 = SI2304DDS-T1-GE3: MOSFET N-CH 30V 3.3A/3.6A SOT23; Manufacturer 1: Vishay Siliconix; Nominal Vgs: 2.2V; Rds On Max: 850mR; Input Capacitance: 35pF; Rise Time: 50ns; Continuous Drain Current (ID): 3.6A; Max Power Dissipation: 200mW; Drain to Source Resistance: 49mR; Number of Elements: 1; Power Dissipation: 1.1W; Turn-Off Delay Time: 12ns; Fall Time: 22ns; Element Configuration: Single; Gate to Source Voltage (Vgs): 20V; On-State Resistance: 60mR; Polarity: N-CHANNEL; Supplier 1: Digi-Key; Manufacturer Part Number 1: SI2304DDS-T1-GE3; RoHS: Yes; Category: MOSFETs; Stock 1: 5879; Pricing 1: 1=0,45000, 10=0,36200, 100=0,24640, 500=0,18480, 1000=0,13860 (USD); Mount: Surface Mount; Case/Package: SOT-23-3; Number of Pins: 3; Weight: 0.050717oz; Contact Plating: Tin,Matte; Min Operating Temperature: -55°C; Max Operating Temperature: 150°C; Packaging: Tape and Reel; Package Quantity: 3000; Drain to Source Voltage (Vdss): 30V; Drain to Source Breakdown Voltage: 30V; Threshold Voltage: 2.2V; Turn-On Delay Time: 12ns; Number of Channels: 1; Series: TrenchFET®; Drain-source On Resistance-Max: 60mR; Radiation Hardening: No; REACH SVHC: No SVHC; Lead Free: Lead Free; RoHS Compliant: Yes; ComponentLink1URL: https://datasheet.ciiva.com/5769/si2304dd-5769090.pdf?src-supplier=Farnell; ComponentLink1Description: https://datasheet.ciiva.com/5769/si2304dd-5769090.pdf?src-supplier=Farnell; ComponentLink2URL: https://datasheet.ciiva.com/7370/1750671-7370955.pdf?src-supplier=Newark; ComponentLink2Description: https://datasheet.ciiva.com/7370/1750671-7370955.pdf?src-supplier=Newark; ComponentLink3URL: https://datasheet.ciiva.com/4441/si2304dd-244438-4441695.pdf?src-supplier=Mouser; ComponentLink3Description: https://datasheet.ciiva.com/4441/si2304dd-244438-4441695.pdf?src-supplier=Mouser; ComponentLink4URL: https://datasheet.ciiva.com/2957/si2304dd-2957371.pdf?src-supplier=Digi-Key; ComponentLink4Description: https://datasheet.ciiva.com/2957/si2304dd-2957371.pdf?src-supplier=Digi-Key; ComponentLink5URL: https://datasheet.ciiva.com/7788/si2304dd-7788750.pdf?src-supplier=Element14; ComponentLink5Description: https://datasheet.ciiva.com/7788/si2304dd-7788750.pdf?src-supplier=Element14; ComponentLink6URL: https://datasheet.ciiva.com/8115/si2304dd-8115070.pdf?src-supplier=Avnet; ComponentLink6Description: https://datasheet.ciiva.com/8115/si2304dd-8115070.pdf?src-supplier=Avnet; ComponentLink7URL: https://datasheet.ciiva.com/2957/si2304dd-2957372.pdf?src-supplier=Digi-Key; ComponentLink7Description: https://datasheet.ciiva.com/2957/si2304dd-2957372.pdf?src-supplier=Digi-Key; ComponentLink8URL: https://datasheet.ciiva.com/26137/si2304dd-26137837.pdf?src-supplier=Avnet+Europe; ComponentLink8Description: https://datasheet.ciiva.com/26137/si2304dd-26137837.pdf?src-supplier=Avnet+Europe; Supplier Part Number 1: SI2304DDS-T1-GE3CT-ND
R13#2 = RC0603FR-07100RL: as R4 on sheet Gastroscopy-CutController_Button; Supplier 1: Arrow Electronics; RoHS: Yes; Category: Chip SMD Resistors; Stock 1: 17580000; Pricing 1: 5000=0,00180 (USD); Case/Package: 0603; Number of Pins: 2; Case Code (Imperial): 0603; Case Code (Metric): 1608; Size Code: 0603; Min Operating Temperature: -55°C; Max Operating Temperature: 155°C; Resistance: 100R; Tolerance: 1%; Packaging: Tape and Reel; Resistor Type: Thick Film; Voltage Rating: 50V; Termination: SMD/SMT; Features: Moisture Resistant; Series: RC; Max Power Dissipation: 100mW; Number of Terminations: 2; Construction: Rectangular; Resistance Tolerance: 1%; Technology: THICK FILM; Length: 1.6mm; Width: 0.8mm; Height: 0.45mm; Depth: 0.8mm; REACH SVHC: Unknown; Lead Free: Lead Free; Military Standard: Not; RoHS Compliant: Yes; Supplier Part Number 1: RC0603FR-07100RL; Manufacturer Part Number 1: RC0603FR-07100RL
R14 = RC0603FR-0710KL: as R1 on sheet Gastroscopy-CutController_Accelerometer; Supplier 1: Arrow Electronics; RoHS: Yes; Category: Chip SMD Resistors; Stock 1: 4950000; Pricing 1: 5000=0,00240 (USD); Case/Package: 0603; Number of Pins: 2; Case Code (Imperial): 0603; Case Code (Metric): 1608; Weight: 7.1E-05oz; Size Code: 0603; Min Operating Temperature: -55°C; Max Operating Temperature: 155°C; Packaging: Tape and Reel; Resistance: 10kR; Tolerance: 1%; Resistor Type: Thick Film; Termination: SMD/SMT; Features: Moisture Resistant; Series: RC; Max Power Dissipation: 100mW; Number of Terminations: 2; Resistance Tolerance: 1%; Construction: Rectangular; Length: 1.6mm; Width: 0.8mm; Height: 0.45mm; Depth: 0.8mm; Lead Pitch: 0.3mm; REACH SVHC: Unknown; Lead Free: Lead Free; Military Standard: Not; RoHS Compliant: Yes; ComponentLink1URL: https://datasheet.ciiva.com/7660/38590-7660789.pdf?src-supplier=Element14; ComponentLink1Description: https://datasheet.ciiva.com/7660/38590-7660789.pdf?src-supplier=Element14; ComponentLink2URL: https://datasheet.ciiva.com/7983/443971-7983596.pdf?src-supplier=Element14; ComponentLink2Description: https://datasheet.ciiva.com/7983/443971-7983596.pdf?src-supplier=Element14; ComponentLink3URL: https://datasheet.ciiva.com/22747/443971-22747519.pdf?src-supplier=Element14; ComponentLink3Description: https://datasheet.ciiva.com/22747/443971-22747519.pdf?src-supplier=Element14; ComponentLink4URL: https://datasheet.ciiva.com/46440/1868787-46440891.pdf?src-supplier=Element14; ComponentLink4Description: https://datasheet.ciiva.com/46440/1868787-46440891.pdf?src-supplier=Element14; ComponentLink5URL: https://datasheet.ciiva.com/7746/1738695-7746239.pdf?src-supplier=Element14; ComponentLink5Description: https://datasheet.ciiva.com/7746/1738695-7746239.pdf?src-supplier=Element14; Supplier Part Number 1: RC0603FR-0710KL; Manufacturer Part Number 1: RC0603FR-0710KL

## Sheet Gastroscopy-CutController_LED.SchDoc: LED Driver
size 279 x 215 mm; Date: not used; ApprovedBy: not used; CheckedBy: not used; Author: not used; CompanyName: MRobot, LCC; DrawnBy: not used; Engineer: Podlesnyi Vasilii; Organization: not used; Address1: nab. reki Karpovki, d. 5/3E; Address2: Saint-Petersburg, 197022; Address3: Ph: +7 (911) 701-51-99; Address4: not used; DocumentNumber: 0000-0000; Revision: 0.1.0; SheetNumber: 5; SheetTotal: 8; ProjectTitle: Gastroscopy CutController; Time: not used; ImagePath: not used; Application_BuildNumber: not used
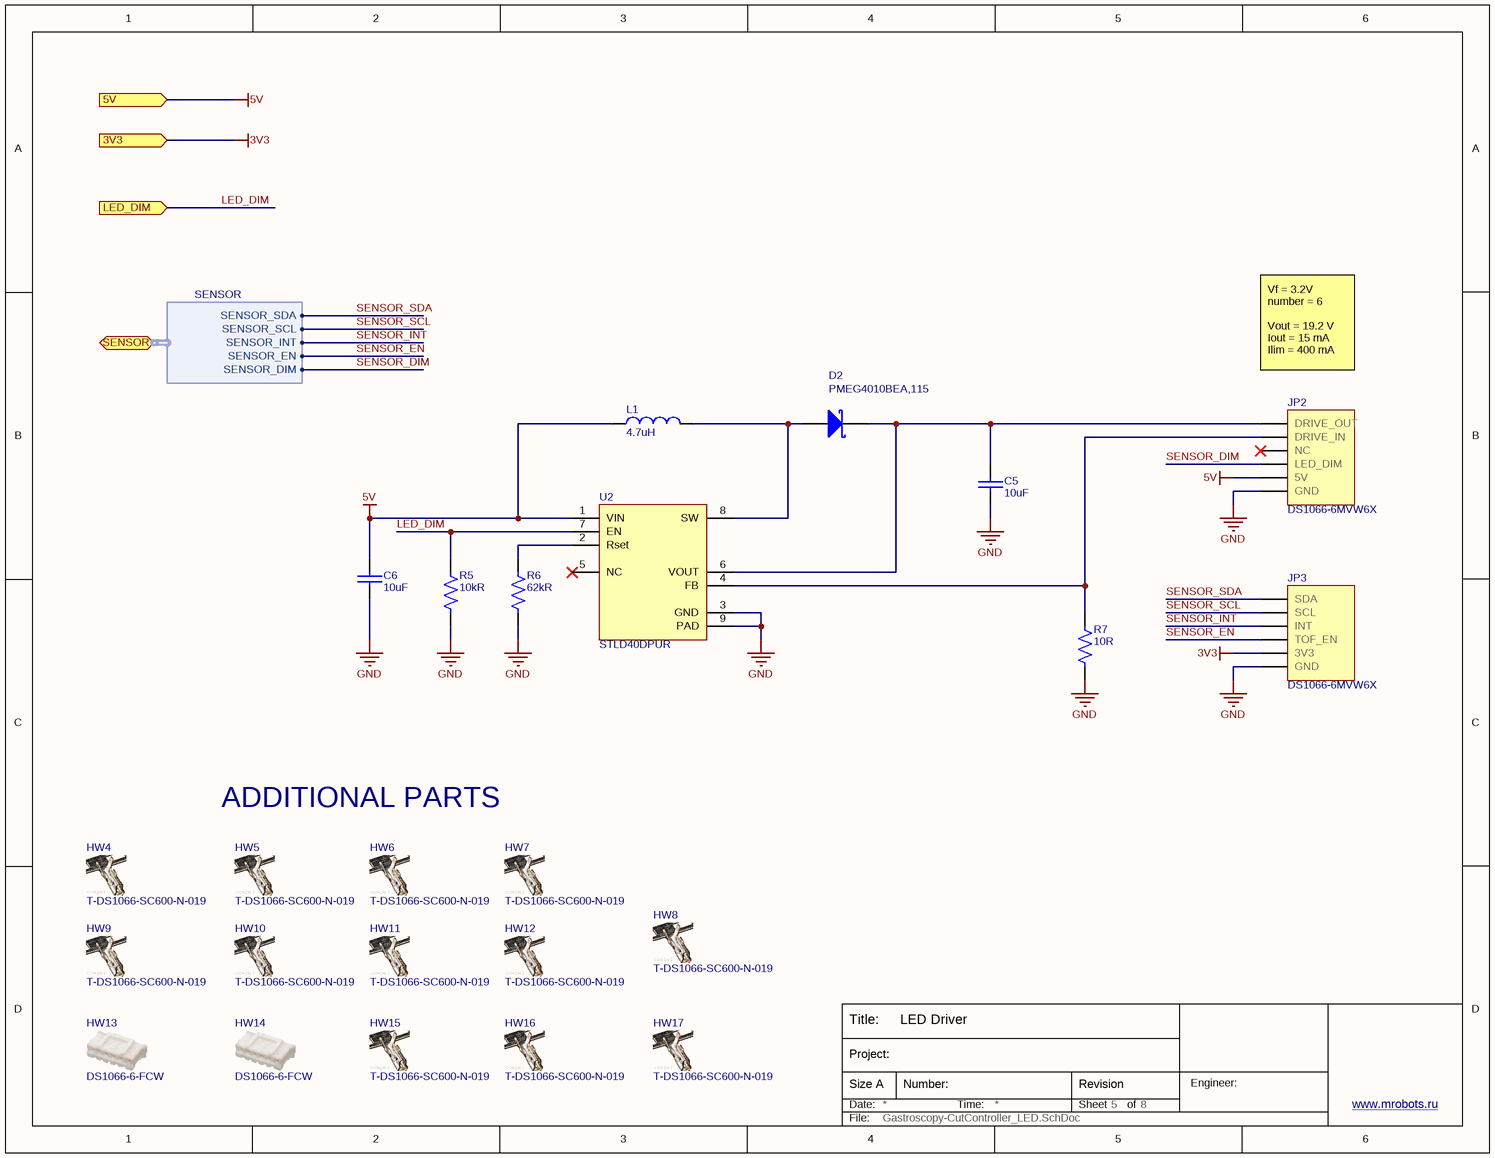
[diagram p7: Gastroscopy-CutController_LED.SchDoc]

### Parts
(Parts that share a designator on the sheet are numbered #1, #2 ... from top to bottom, then left to right.)
C5#2  10uF  [CAP_0805]
C6#2  10uF  [CAP_0805]
D2#2  PMEG4010BEA,115  [SOD-323]
HW4  T-DS1066-SC600-N-019  (mechanical)
HW5  T-DS1066-SC600-N-019  (mechanical)
HW6  T-DS1066-SC600-N-019  (mechanical)
HW7  T-DS1066-SC600-N-019  (mechanical)
HW8  T-DS1066-SC600-N-019  (mechanical)
HW9  T-DS1066-SC600-N-019  (mechanical)
HW10  T-DS1066-SC600-N-019  (mechanical)
HW11  T-DS1066-SC600-N-019  (mechanical)
HW12  T-DS1066-SC600-N-019  (mechanical)
HW13  DS1066-6-FCW  (mechanical)
HW14  DS1066-6-FCW  (mechanical)
HW15  T-DS1066-SC600-N-019  (mechanical)
HW16  T-DS1066-SC600-N-019  (mechanical)
HW17  T-DS1066-SC600-N-019  (mechanical)
JP2#2  DS1066-6MVW6X  [DS1066-6MVW6X]
JP3#2  DS1066-6MVW6X  [DS1066-6MVW6X]
L1  4.7uH  [NLC453232T-4R7K-PF]
R5#2  10kR  [RES_0603]
R6#2  62kR  [RES_0603]
R7#2  10R  [RES_0603]
U2  STLD40DPUR  [STLD40DPUR]

### Ports
3V3 (in), 5V (in), LED_DIM (in), SENSOR (bidir, harness SENSOR)

### Harnesses
SENSOR: SENSOR_SDA, SENSOR_SCL, SENSOR_INT, SENSOR_EN, SENSOR_DIM

### Nets
3V3: JP3#2.5 ; port 3V3
5V: C6#2.2 JP2#2.5 L1.1 U2.1(VIN) ; port 5V
GND: C5#2.1 C6#2.1 JP2#2.6 JP3#2.6 R5#2.2 R6#2.2 R7#2.2 U2.3(GND) U2.9(PAD)
LED_DIM: R5#2.1 U2.7(EN) ; port LED_DIM
SENSOR_DIM: JP2#2.4 ; port SENSOR.SENSOR_DIM
SENSOR_EN: JP3#2.4 ; port SENSOR.SENSOR_EN
SENSOR_INT: JP3#2.3 ; port SENSOR.SENSOR_INT
SENSOR_SCL: JP3#2.2 ; port SENSOR.SENSOR_SCL
SENSOR_SDA: JP3#2.1 ; port SENSOR.SENSOR_SDA
NetC5#2_2: C5#2.2 D2#2.1(K) JP2#2.1 U2.6(VOUT)
NetD2#2_2: D2#2.2(A) L1.2 U2.8(SW)
NetJP2#2_2: JP2#2.2 R7#2.1 U2.4(FB)
NetR6#2_1: R6#2.1 U2.2(Rset)

Not connected (* = marked no-connect by the designer): JP2#2 3*; U2 5(NC)*

### Notes on the sheet
- Vf = 3.2V
  number = 6
  Vout = 19.2 V
  Iout = 15 mA
  Ilim = 400 mA
- ADDITIONAL PARTS
- Title:
- Date:
- Size A
- Project:
- Number:
- Time:
- Sheet
- Revision
- of
- Engineer:
- www.mrobots.ru <http://mrobots.ru/>
- File:

### Library data of the parts
C5#2 C6#2 = CL21B106KOQNNNE: CAP CER 10UF 16V X7R 0805; Manufacturer 1: Samsung; Tolerance: 10%; Supplier 1: Avnet; Manufacturer Part Number 1: CL21B106KOQNNNE; RoHS: Yes; Category: Ceramic Capacitors; Stock 1: 1089000; Pricing 1: 2000=0,02892, 4000=0,02851, 8000=0,02768, 12000=0,02707, 16000=0,02603 (USD); Mount: Surface Mount; Case/Package: 0805; Case Code (Metric): 2012; Case Code (Imperial): 0805; Contact Plating: Tin; Min Operating Temperature: -55°C; Max Operating Temperature: 125°C; Packaging: Tape and Reel; Capacitance: 10uF; Voltage Rating: 16V; Package Quantity: 1; Dielectric: X7R; Series: CL; Construction: Flat; Voltage: 16V; Length: 2mm; Width: 0.049inch; Height: 1.25mm; Thickness: 0.055inch; Depth: 1.25mm; Radiation Hardening: No; RoHS Compliant: Yes; ComponentLink1URL: https://datasheet.ciiva.com/25794/cl21b106koqnnne-25794472.pdf?src-supplier=Digi-Key; ComponentLink1Description: https://datasheet.ciiva.com/25794/cl21b106koqnnne-25794472.pdf?src-supplier=Digi-Key; ComponentLink2URL: https://datasheet.ciiva.com/16428/cl21b106koqnnne-16428887.pdf?src-supplier=Future+Electronics; ComponentLink2Description: https://datasheet.ciiva.com/16428/cl21b106koqnnne-16428887.pdf?src-supplier=Future+Electronics; ComponentLink3URL: https://datasheet.ciiva.com/26920/getdatasheetpartid-355170-26920201.pdf?src-supplier=Verical; ComponentLink3Description: https://datasheet.ciiva.com/26920/getdatasheetpartid-355170-26920201.pdf?src-supplier=Verical; Supplier Part Number 1: CL21B106KOQNNNE
D2#2 = PMEG4010BEA,115: as D5 on sheet Gastroscopy-CutController_Relay; Supplier 1: RSComponents; Manufacturer Part Number: PMEG4010BEA,115; RoHS: Yes; Category: Rectifier Diodes; Stock 1: 163320; Pricing 1: 160=0,18400, 760=0,16200, 1500=0,13800 (GBP); RoHS Compliant: Yes; ComponentLink1URL: http://www.farnell.com/datasheets/689588.pdf?src-supplier=Farnell; ComponentLink1Description: http://www.farnell.com/datasheets/689588.pdf?src-supplier=Farnell; Supplier Part Number 1: 485644P
HW4-HW12 HW15-HW17 = T-DS1066-SC600-N-019: as HW2 on sheet Gastroscopy-CutController_Button; Manufacturer Part Number 1: T-DS1066-SC600-N-019
HW13 HW14 = DS1066-6-FCW: CONN SOCKET 6POS 2MM; Manufacturer 1: Connfly electronic (Zhenqin); Manufacturer Part Number 1: DS1066-6-FCW
JP2#2 = DS1066-6MVW6X: CONN PLUG 6POS 2MM; Manufacturer 1: Connfly electronic (Zhenqin); Contact_1: DRIVE_OUT; Contact_2: DRIVE_IN; Contact_3: NC; Contact_4: LED_DIM; Contact_5: 5V; Contact_6: GND; Manufacturer Part Number 1: DS1066-6MVW6X
JP3#2 = DS1066-6MVW6X: CONN PLUG 6POS 2MM; Manufacturer 1: Connfly electronic (Zhenqin); Contact_1: SDA; Contact_2: SCL; Contact_3: INT; Contact_4: TOF_EN; Contact_5: 3V3; Contact_6: GND; Manufacturer Part Number 1: DS1066-6MVW6X
L1 = NLC453232T-4R7K-PF: FIXED IND 4.7UH 650MA 270MOHM SM; Manufacturer: TDK; Core Material: Ferrite; Tolerance: 10%; Shielding: Unshielded; Q Factor: 10; Self Resonant Frequency: 35MHz; Resistance: 270mR; Test Frequency: 7.96MHz; Inductor Type: POWER; Supplier 1: Arrow Electronics; Manufacturer Part Number: NLC453232T-4R7K-PF; RoHS: Yes; Category: Fixed Inductors; Stock 1: 6500; Pricing 1: 500=0,20930, 1000=0,16890 (USD); Mount: Surface Mount; Case/Package: 1812; Number of Pins: 2; Case Code (Metric): 4532; Case Code (Imperial): 1812; Weight: 180mg; Min Operating Temperature: -40°C; Max Operating Temperature: 105°C; Package Quantity: 500; Current Rating: 650mA; Packaging: Tape and Reel; Inductance Tolerance: 10%; Resistor Type: Wirewound; Inductance: 4.7uH; DC Resistance (DCR): 270mR; Max DC Current: 650mA; Termination: SMD/SMT; DC Current: 650mA; Series: NLC; Rated Current-Max: 650mA; Length: 4.8mm; Width: 0.126inch; Height: 3.2mm; Height - Seated (Max): 0.134inch; Depth: 3.4mm; Radiation Hardening: No; Reach SVHC Compliant: Yes; Military Standard: Not; Lead Free: Lead Free; RoHS Compliant: Yes; ComponentLink1URL: https://datasheet.ciiva.com/15160/getdatasheetpartid-200345-15160695.pdf?src-supplier=Verical; ComponentLink1Description: https://datasheet.ciiva.com/15160/getdatasheetpartid-200345-15160695.pdf?src-supplier=Verical; ComponentLink2URL: https://datasheet.ciiva.com/49516/1871457-49516870.pdf?src-supplier=Jameco; ComponentLink2Description: https://datasheet.ciiva.com/49516/1871457-49516870.pdf?src-supplier=Jameco; ComponentLink3URL: https://datasheet.ciiva.com/22622/1505805-22622665.pdf?src-supplier=Element14; ComponentLink3Description: https://datasheet.ciiva.com/22622/1505805-22622665.pdf?src-supplier=Element14; ComponentLink4URL: https://datasheet.ciiva.com/15987/e531-nlc4532-15987565.pdf?src-supplier=Onlinecomponents.com; ComponentLink4Description: https://datasheet.ciiva.com/15987/e531-nlc4532-15987565.pdf?src-supplier=Onlinecomponents.com; Supplier Part Number 1: NLC453232T-4R7K-PF
R5#2 = RC0603FR-0710KL: as R1 on sheet Gastroscopy-CutController_Accelerometer; Supplier 1: Arrow Electronics; RoHS: Yes; Category: Chip SMD Resistors; Stock 1: 4950000; Pricing 1: 5000=0,00240 (USD); Case/Package: 0603; Number of Pins: 2; Case Code (Imperial): 0603; Case Code (Metric): 1608; Weight: 7.1E-05oz; Size Code: 0603; Min Operating Temperature: -55°C; Max Operating Temperature: 155°C; Packaging: Tape and Reel; Resistance: 10kR; Tolerance: 1%; Resistor Type: Thick Film; Termination: SMD/SMT; Features: Moisture Resistant; Series: RC; Max Power Dissipation: 100mW; Number of Terminations: 2; Resistance Tolerance: 1%; Construction: Rectangular; Length: 1.6mm; Width: 0.8mm; Height: 0.45mm; Depth: 0.8mm; Lead Pitch: 0.3mm; REACH SVHC: Unknown; Lead Free: Lead Free; Military Standard: Not; RoHS Compliant: Yes; ComponentLink1URL: https://datasheet.ciiva.com/7660/38590-7660789.pdf?src-supplier=Element14; ComponentLink1Description: https://datasheet.ciiva.com/7660/38590-7660789.pdf?src-supplier=Element14; ComponentLink2URL: https://datasheet.ciiva.com/7983/443971-7983596.pdf?src-supplier=Element14; ComponentLink2Description: https://datasheet.ciiva.com/7983/443971-7983596.pdf?src-supplier=Element14; ComponentLink3URL: https://datasheet.ciiva.com/22747/443971-22747519.pdf?src-supplier=Element14; ComponentLink3Description: https://datasheet.ciiva.com/22747/443971-22747519.pdf?src-supplier=Element14; ComponentLink4URL: https://datasheet.ciiva.com/46440/1868787-46440891.pdf?src-supplier=Element14; ComponentLink4Description: https://datasheet.ciiva.com/46440/1868787-46440891.pdf?src-supplier=Element14; ComponentLink5URL: https://datasheet.ciiva.com/7746/1738695-7746239.pdf?src-supplier=Element14; ComponentLink5Description: https://datasheet.ciiva.com/7746/1738695-7746239.pdf?src-supplier=Element14; Supplier Part Number 1: RC0603FR-0710KL; Manufacturer Part Number 1: RC0603FR-0710KL
R6#2 = RC0603FR-0762KL: RES 62K OHM 1% 1/10W 0603; Manufacturer: Yageo; Power Rating: 100mW; Voltage Rating: 50V; Temperature Coefficient: 100ppm/°C; Supplier 1: Avnet; Manufacturer Part Number: RC0603FR-0762KL; RoHS: Yes; Category: Chip SMD Resistors; Stock 1: 75000; Pricing 1: 5000=0,00133, 10000=0,00131, 20000=0,00127 (USD); Case/Package: 0603; Case Code (Metric): 1608; Case Code (Imperial): 0603; Size Code: 0603; Min Operating Temperature: -55°C; Max Operating Temperature: 155°C; Package Quantity: 1; Resistance: 62kR; Tolerance: 1%; Packaging: Tape and Reel; Resistor Type: Thick Film; Number of Terminations: 2; Termination: SMD/SMT; Max Power Dissipation: 100mW; Voltage Rating (DC): 50V; Features: Moisture Resistant; Series: RC; Construction: Rectangular; Length: 1.6mm; Width: 0.031inch; Height: 0.022inch; Depth: 0.8mm; Military Standard: Not; Lead Free: Lead Free; RoHS Compliant: Yes; ComponentLink1URL: https://datasheet.ciiva.com/2454/pyu-r-int-thick-7-2454127.pdf?src-supplier=Digi-Key; ComponentLink1Description: https://datasheet.ciiva.com/2454/pyu-r-int-thick-7-2454127.pdf?src-supplier=Digi-Key; ComponentLink2URL: https://datasheet.ciiva.com/2454/pyu-r-int-thick-7-2454128.pdf?src-supplier=Digi-Key; ComponentLink2Description: https://datasheet.ciiva.com/2454/pyu-r-int-thick-7-2454128.pdf?src-supplier=Digi-Key; ComponentLink3URL: https://datasheet.ciiva.com/2454/pyu-r-int-thick-7-2454126.pdf?src-supplier=Digi-Key; ComponentLink3Description: https://datasheet.ciiva.com/2454/pyu-r-int-thick-7-2454126.pdf?src-supplier=Digi-Key; ComponentLink4URL: https://datasheet.ciiva.com/12558/rc0603-272842-12558365.pdf?src-supplier=Mouser; ComponentLink4Description: https://datasheet.ciiva.com/12558/rc0603-272842-12558365.pdf?src-supplier=Mouser; Supplier Part Number 1: RC0603FR-0762KL
R7#2 = RC0603FR-0710RL: RES 10 OHM 1% 1/10W 0603; Manufacturer 1: Yageo; Voltage Rating (DC): 50V; Temperature Coefficient: 200ppm/°C; Max Power Dissipation: 100mW; Supplier 1: RSComponents; RoHS: Yes; Category: Chip SMD Resistors; Stock 1: 6700; Pricing 1: 100=0,01600, 1000=0,01500, 2500=0,01400, 5000=0,01300, 10000=0,01200 (GBP); Case/Package: 0603; Number of Pins: 2; Case Code (Imperial): 0603; Case Code (Metric): 1608; Contact Plating: Tin,Matte; Size Code: 0603; Min Operating Temperature: -55°C; Max Operating Temperature: 155°C; Packaging: Tape and Reel; Resistance: 10R; Tolerance: 1%; Resistor Type: Thick Film; Features: Moisture Resistant; Series: RC; Number of Terminations: 2; Power Rating: 100mW; Voltage Rating: 50V; Termination: SMD/SMT; Resistance Tolerance: 1%; Construction: Rectangular; Technology: THICK FILM; Length: 1.6mm; Width: 0.8mm; Height: 0.45mm; Depth: 0.8mm; Radiation Hardening: No; Lead Free: Lead Free; RoHS Compliant: Yes; Reach SVHC Compliant: Yes; Military Standard: Not; ComponentLink1URL: https://datasheet.ciiva.com/11808/0900766b80f96399-11808140.pdf?src-supplier=RSComponents; ComponentLink1Description: https://datasheet.ciiva.com/11808/0900766b80f96399-11808140.pdf?src-supplier=RSComponents; ComponentLink2URL: https://datasheet.ciiva.com/7746/443971-7746245.pdf?src-supplier=Element14; ComponentLink2Description: https://datasheet.ciiva.com/7746/443971-7746245.pdf?src-supplier=Element14; ComponentLink3URL: https://datasheet.ciiva.com/8891/pyu-rc0603-51-rohs-l-4-8891285.pdf?src-supplier=Avnet; ComponentLink3Description: https://datasheet.ciiva.com/8891/pyu-rc0603-51-rohs-l-4-8891285.pdf?src-supplier=Avnet; Supplier Part Number 1: 1995445; Manufacturer Part Number 1: RC0603FR-0710RL
U2 = STLD40DPUR: IC LED DRVR RGLTR PWM 20MA 8QFN; Manufacturer 1: STMicroelectronics; Min Input Voltage: 3V; Max Input Voltage: 5.5V; Number of Outputs: 1; Output Voltage: 37V; Efficiency: 80%; Max Supply Current: 1.2mA; Topology: Boost; Output Type: Adjustable; Supplier 1: Arrow Electronics; Manufacturer Part Number 1: STLD40DPUR; RoHS: Yes; Category: Power Supply Modules; Stock 1: 11940; Pricing 1: 1=2,55430, 10=2,53990, 25=2,52560, 100=2,51140, 250=2,49700, 500=2,48270, 1000=2,46850, 3000=2,45410, 6000=2,43980 (USD); Mount: Surface Mount; Case/Package: QFN; Number of Pins: 8; Min Operating Temperature: -40°C; Max Operating Temperature: 85°C; Output Current: 20mA; Packaging: Tape and Reel; Package Quantity: 1; Operating Supply Voltage: 5.5V; Output Current per Channel: 20mA; Series: -; Radiation Hardening: No; Reach SVHC Compliant: No; Lead Free: Lead Free; RoHS Compliant: Yes; ComponentLink1URL: https://datasheet.ciiva.com/16491/cd00098098-16491024.pdf?src-supplier=Future+Electronics; ComponentLink1Description: https://datasheet.ciiva.com/16491/cd00098098-16491024.pdf?src-supplier=Future+Electronics; ComponentLink2URL: https://datasheet.ciiva.com/41457/001186075-da-01-en-ic-led-driver-white-stld40dpur-qfn-8-stm-41457402.pdf?src-supplier=Conrad; ComponentLink2Description: https://datasheet.ciiva.com/41457/001186075-da-01-en-ic-led-driver-white-stld40dpur-qfn-8-stm-41457402.pdf?src-supplier=Conrad; ComponentLink3URL: https://datasheet.ciiva.com/1945/cd00098098-1945372.pdf?src-supplier=Digi-Key; ComponentLink3Description: https://datasheet.ciiva.com/1945/cd00098098-1945372.pdf?src-supplier=Digi-Key; ComponentLink4URL: https://datasheet.ciiva.com/1945/cd00098098-1945373.pdf?src-supplier=Digi-Key; ComponentLink4Description: https://datasheet.ciiva.com/1945/cd00098098-1945373.pdf?src-supplier=Digi-Key; ComponentLink5URL: https://datasheet.ciiva.com/1945/cd00098098-1945374.pdf?src-supplier=Digi-Key; ComponentLink5Description: https://datasheet.ciiva.com/1945/cd00098098-1945374.pdf?src-supplier=Digi-Key; Supplier Part Number 1: STLD40DPUR

## Nets that join several sheets
3V3: Gastroscopy-CutController_MCU (14 pins), Gastroscopy-CutController_USB (C17.1 C18.2 DA2#1.5 R15.1), Gastroscopy-CutController_Accelerometer (C1.1 C2.1 U1.1 U1.14), Overview/Buttons1 (R3.1), Overview/Buttons2 (R6#1.1), Overview/Buttons3 (R9#2.1), Overview/Buttons4 (R12#2.1), Gastroscopy-CutController_LED (JP3#2.5)
5V: Gastroscopy-CutController_USB (11 pins), Overview/Buttons1 (R2.1), Overview/Buttons2 (R5#1.1), Overview/Buttons3 (R8#2.1), Overview/Buttons4 (R11#2.1), Gastroscopy-CutController_Relay (D5.1 K1.A1), Gastroscopy-CutController_LED (C6#2.2 JP2#2.5 L1.1 U2.1)
GND: Gastroscopy-CutController_MCU (21 pins), Gastroscopy-CutController_USB (14 pins), Gastroscopy-CutController_Accelerometer (6 pins), Overview/Buttons1 (C4.2 D1.2 DA1.3 JP1.2), Overview/Buttons2 (C6#1.2 D2#1.2 DA2#2.3 JP2#1.2), Overview/Buttons3 (C8#2.2 D3#2.2 DA3.3 JP3#1.2), Overview/Buttons4 (C10#2.2 D4#2.2 DA4.3 JP4#2.2), Gastroscopy-CutController_Relay (D6.2 Q1.2 R14.2), Gastroscopy-CutController_LED (9 pins)
ACCEL_CLK: Gastroscopy-CutController_MCU (U3.15), Gastroscopy-CutController_Accelerometer (U1.4)
ACCEL_CS: Gastroscopy-CutController_MCU (U3.14), Gastroscopy-CutController_Accelerometer (R1.1 U1.8)
ACCEL_INT1: Gastroscopy-CutController_MCU (U3.12), Gastroscopy-CutController_Accelerometer (U1.11)
ACCEL_INT2: Gastroscopy-CutController_MCU (U3.13), Gastroscopy-CutController_Accelerometer (U1.9)
ACCEL_MISO: Gastroscopy-CutController_MCU (U3.16), Gastroscopy-CutController_Accelerometer (U1.7)
ACCEL_MOSI: Gastroscopy-CutController_MCU (U3.17), Gastroscopy-CutController_Accelerometer (U1.6)
LED_DIM: Gastroscopy-CutController_MCU (U3.31), Gastroscopy-CutController_LED (R5#2.1 U2.7)
MCU_USB_D_N: Gastroscopy-CutController_MCU (U3.32), Gastroscopy-CutController_USB (R16.1)
MCU_USB_D_P: Gastroscopy-CutController_MCU (U3.33), Gastroscopy-CutController_USB (R17.1)
RELAY: Gastroscopy-CutController_MCU (U3.25), Gastroscopy-CutController_Relay (R13#2.1)
SENSOR_DIM: Gastroscopy-CutController_MCU (U3.30), Gastroscopy-CutController_LED (JP2#2.4)
SENSOR_EN: Gastroscopy-CutController_MCU (U3.40), Gastroscopy-CutController_LED (JP3#2.4)
SENSOR_INT: Gastroscopy-CutController_MCU (U3.41), Gastroscopy-CutController_LED (JP3#2.3)
SENSOR_SCL: Gastroscopy-CutController_MCU (U3.42), Gastroscopy-CutController_LED (JP3#2.2)
SENSOR_SDA: Gastroscopy-CutController_MCU (U3.43), Gastroscopy-CutController_LED (JP3#2.1)